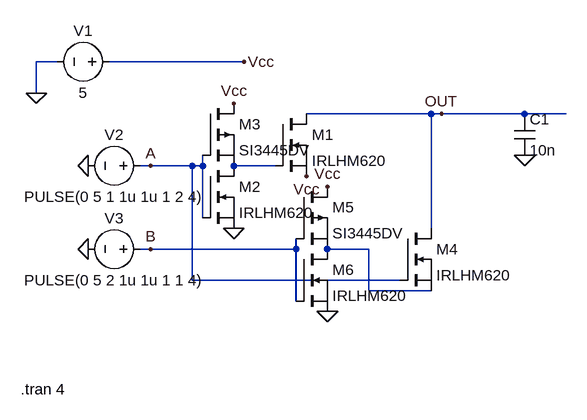
[diagram p0: schematic NAND PTL.asc]
NAND PTL.asc, the LTspice schematic file:
Version 4.1
SHEET 1 880 680
WIRE -128 -16 -160 -16
WIRE 160 -16 -48 -16
WIRE -160 32 -160 -16
WIRE 448 64 256 64
WIRE 464 64 448 64
WIRE 592 64 464 64
WIRE 656 64 592 64
WIRE 16 144 0 144
WIRE 80 144 16 144
WIRE 96 144 96 128
WIRE 96 144 80 144
WIRE 208 144 144 144
WIRE 96 224 96 144
WIRE 448 240 448 64
WIRE 16 272 0 272
WIRE 240 272 240 256
WIRE 240 272 16 272
WIRE 352 272 288 272
WIRE 80 320 80 144
WIRE 400 320 80 320
WIRE 352 336 352 272
WIRE 448 336 352 336
WIRE 240 352 240 272
FLAG -160 32 0
FLAG 160 -16 Vcc
FLAG -80 144 0
FLAG -80 272 0
FLAG 144 48 Vcc
FLAG 144 240 0
FLAG 16 144 A
FLAG 16 272 B
FLAG 464 64 OUT
FLAG 288 176 Vcc
FLAG 288 368 0
FLAG 256 160 Vcc
FLAG 592 128 0
SYMBOL voltage -32 -16 R90
WINDOW 0 -32 56 VBottom 2
WINDOW 3 32 56 VTop 2
WINDOW 123 0 0 Left 0
WINDOW 39 0 0 Left 0
SYMATTR InstName V1
SYMATTR Value 5
SYMBOL voltage 16 144 R90
WINDOW 0 -32 56 VBottom 2
WINDOW 3 32 56 VTop 2
WINDOW 123 0 0 Left 0
WINDOW 39 0 0 Left 0
SYMATTR InstName V2
SYMATTR Value PULSE(0 5 1 1u 1u 1 2 4)
SYMBOL voltage 16 272 R90
WINDOW 0 -32 56 VBottom 2
WINDOW 3 32 56 VTop 2
WINDOW 123 0 0 Left 0
WINDOW 39 0 0 Left 0
SYMATTR InstName V3
SYMATTR Value PULSE(0 5 2 1u 1u 1 1 4)
SYMBOL nmos 208 64 R0
SYMATTR InstName M1
SYMATTR Value IRLHM620
SYMBOL pmos 96 48 R0
SYMATTR InstName M3
SYMATTR Value SI3445DV
SYMBOL nmos 96 144 R0
SYMATTR InstName M2
SYMATTR Value IRLHM620
SYMBOL nmos 400 240 R0
SYMATTR InstName M4
SYMATTR Value IRLHM620
SYMBOL pmos 240 176 R0
SYMATTR InstName M5
SYMATTR Value SI3445DV
SYMBOL nmos 240 272 R0
SYMATTR InstName M6
SYMATTR Value IRLHM620
SYMBOL cap 576 64 R0
SYMATTR InstName C1
SYMATTR Value 10n
TEXT -184 488 Left 2 !.tran 4

The netlist it stands for:
* NAND PTL.asc
V1 Vcc 0 5
V2 A 0 PULSE(0 5 1 1u 1u 1 2 4)
V3 B 0 PULSE(0 5 2 1u 1u 1 1 4)
M1 OUT N001 Vcc Vcc IRLHM620
M3 Vcc A N001 N001 SI3445DV
M2 N001 A 0 0 IRLHM620
M4 OUT A N002 N002 IRLHM620
M5 Vcc B N002 N002 SI3445DV
M6 N002 B 0 0 IRLHM620
C1 OUT 0 10n
.model NMOS NMOS
.model PMOS PMOS
.lib standard.mos
.tran 4
.backanno
.end